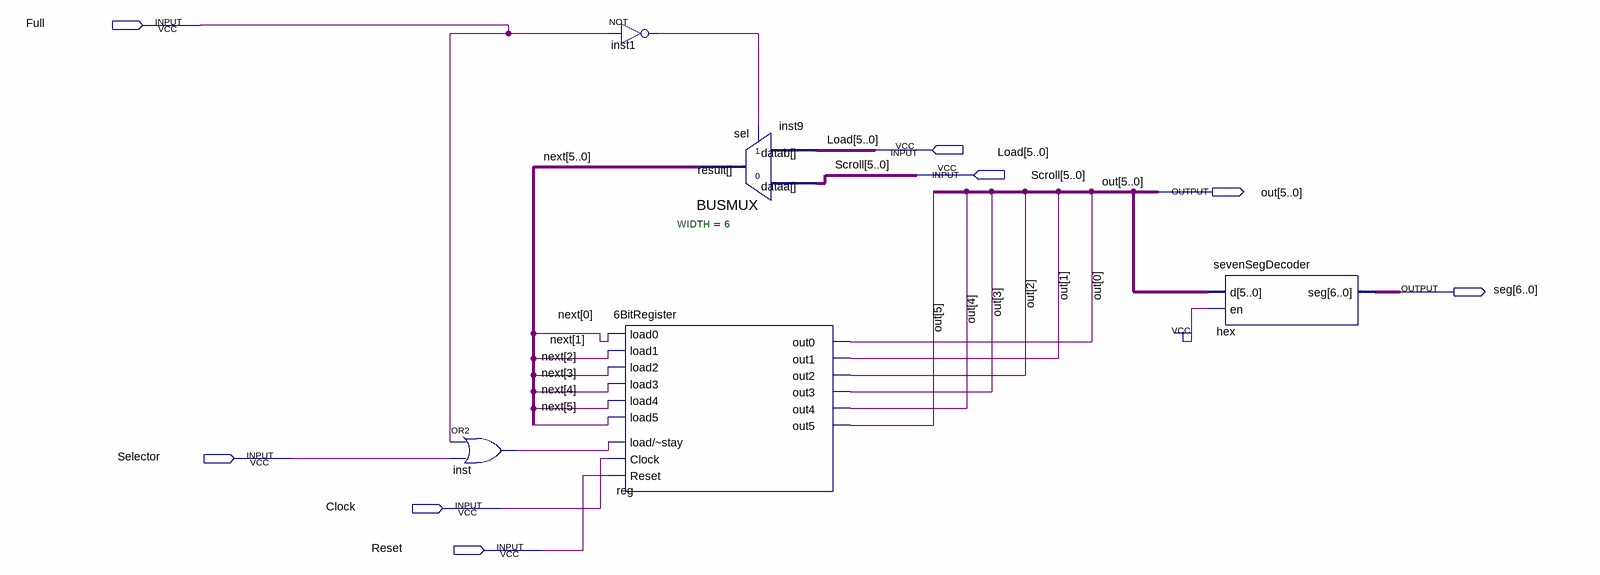
[diagram p0: schematic sheet]
// Quartus schematic RegShiftAnd7Seg.bdf as structural Verilog: 5 symbols, 8 pins
module RegShiftAnd7Seg (
  input  Full,
  input  [5:0] Load,
  input  [5:0] Scroll,
  input  Selector,
  input  Clock,
  input  Reset,
  output [5:0] out,
  output [6:0] seg
);

  wire inst1_out, inst_out;
  wire [5:0] next;

  or inst (inst_out, Full, Selector);
  not inst1 (inst1_out, Full);
  \6BitRegister  \reg  (
    .load4(next[4]), .load3(next[3]), .load2(next[2]), .load1(next[1]), .load0(next[0]), .load5(next[5]),
    .\load/~stay (inst_out), .Clock(Clock), .Reset(Reset), .out0(out[0]), .out1(out[1]), .out2(out[2]),
    .out3(out[3]), .out4(out[4]), .out5(out[5]));
  BUSMUX #(.WIDTH(6)) inst9 (.datab(Load), .sel(inst1_out), .dataa(Scroll), .result(next));
  sevenSegDecoder hex (.d(out), .en(1'b1), .seg(seg));
endmodule
